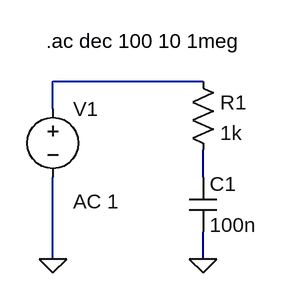
[diagram p0: schematic Draft1.asc]
Draft1.asc, the LTspice schematic file:
Version 4
SHEET 1 880 680
WIRE 256 192 80 192
WIRE 80 224 80 192
WIRE 256 304 256 272
WIRE 80 400 80 304
WIRE 256 400 256 368
FLAG 80 400 0
FLAG 256 400 0
SYMBOL voltage 80 208 R0
WINDOW 123 24 124 Left 2
WINDOW 39 0 0 Left 0
SYMATTR InstName V1
SYMATTR Value ""
SYMATTR Value2 AC 1
SYMBOL res 240 176 R0
SYMATTR InstName R1
SYMATTR Value 1k
SYMBOL cap 240 304 R0
SYMATTR InstName C1
SYMATTR Value 100n
TEXT 72 144 Left 2 !.ac dec 100 10 1meg

The netlist it stands for:
* Draft1.asc
V1 N001 0 AC 1
R1 N001 N002 1k
C1 N002 0 100n
.ac dec 100 10 1meg
.backanno
.end